# Altium project LEDesigner.PrjPcb
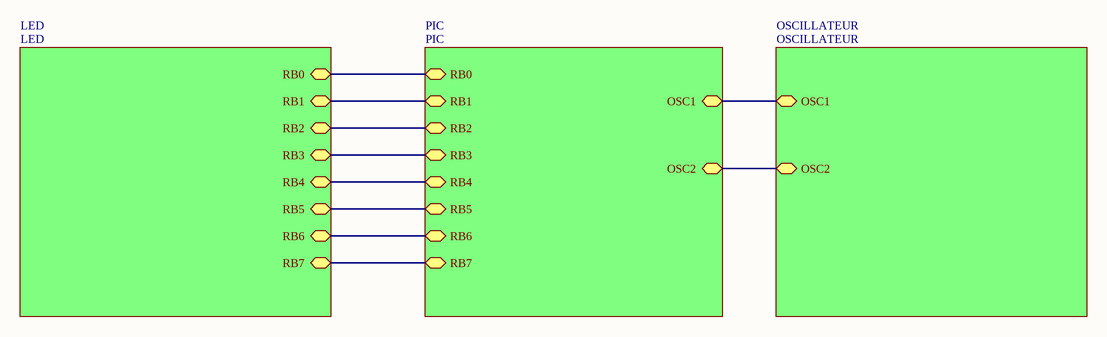
[diagram p0: Afficheur.SchDoc]
4 sheets, 26 parts. Net scope: hierarchical (ports join the sheet entries above them; power ports are global).
Board file: PCB1.PcbDoc
Sheets:
  Afficheur.SchDoc
    PIC = PIC.SchDoc
    OSCILLATEUR = OSCILLATEUR.SchDoc
  LED .SchDoc

## Sheet Afficheur.SchDoc
size A4

### Sub-sheets
LED = LED (file not in this document): RB0, RB1, RB2, RB3, RB4, RB5, RB6, RB7
OSCILLATEUR = OSCILLATEUR: OSC1, OSC2
PIC = PIC: RB0, RB1, RB2, RB3, RB4, RB5, RB6, RB7, OSC1, OSC2

### Nets
NetC3_1: sheet PIC/OSC1, sheet OSCILLATEUR/OSC1
NetC4_1: sheet PIC/OSC2, sheet OSCILLATEUR/OSC2
NetU?_6: sheet PIC/RB0, sheet LED/RB0
NetU?_7: sheet PIC/RB1, sheet LED/RB1
NetU?_8: sheet PIC/RB2, sheet LED/RB2
NetU?_9: sheet PIC/RB3, sheet LED/RB3
NetU?_10: sheet PIC/RB4, sheet LED/RB4
NetU?_11: sheet PIC/RB5, sheet LED/RB5
NetU?_12: sheet PIC/RB6, sheet LED/RB6
NetU?_13: sheet PIC/RB7, sheet LED/RB7

## Sheet PIC.SchDoc
size A4
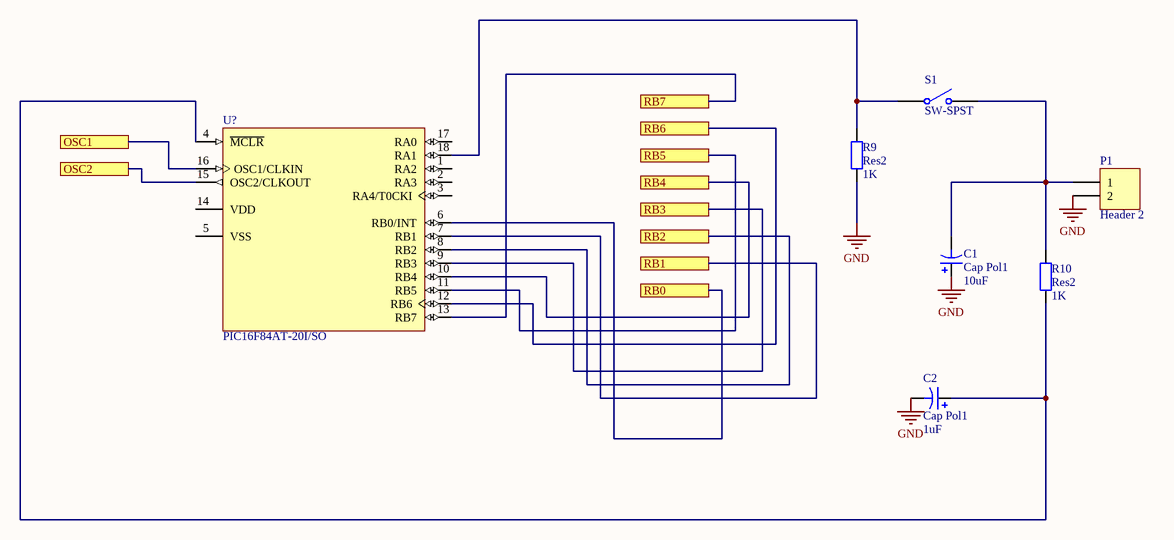
[diagram p1: PIC.SchDoc]

### Parts
C1  Cap Pol1  value 10uF  [RB7.6-15]
C2  Cap Pol1  value 1uF  [RB7.6-15]
P1  Header 2  [HDR1X2]
R9  Res2  value 1K  [AXIAL-0.4]
R10  Res2  value 1K  [AXIAL-0.4]
S1  SW-SPST  [SPST-2]
U?  PIC16F84AT-20I/SO  [SOIC-SO18_N]

### Ports
OSC1, OSC2, RB0, RB1, RB2, RB3, RB4, RB5, RB6, RB7

### Nets
GND: C1.1 C2.2 P1.2 R9.1
NetC1_2: C1.2 P1.1 R10.2 S1.2(NO)
NetC2_1: C2.1 R10.1 U?.4(~{MCLR})
NetC3_1: U?.16(OSC1/CLKIN) ; port OSC1
NetC4_1: U?.15(OSC2/CLKOUT) ; port OSC2
NetR9_2: R9.2 S1.1(COMMON) U?.18(RA1)
NetU?_6: U?.6(RB0/INT) ; port RB0
NetU?_7: U?.7(RB1) ; port RB1
NetU?_8: U?.8(RB2) ; port RB2
NetU?_9: U?.9(RB3) ; port RB3
NetU?_10: U?.10(RB4) ; port RB4
NetU?_11: U?.11(RB5) ; port RB5
NetU?_12: U?.12(RB6) ; port RB6
NetU?_13: U?.13(RB7) ; port RB7

Not connected (* = marked no-connect by the designer): U? 1(RA2) 2(RA3) 3(RA4/T0CKI) 5(VSS) 14(VDD) 17(RA0)

### Library data of the parts
C1 C2 = Cap Pol1: Polarized Capacitor (Radial); Published: 8-Jun-2000; LatestRevisionDate: 17-Jul-2002; LatestRevisionNote: Re-released for DXP Platform.; PackageReference: RB7.6-15; Publisher: Altium Limited; PackageDescription: Polarized Capacitor (Radial); 2 Leads
P1 = Header 2: Header, 2-Pin; LatestRevisionDate: 17-Jul-2002; LatestRevisionNote: Re-released for DXP Platform.; Publisher: Altium Limited
R9 R10 = Res2: Resistor; Published: 8-Jun-2000; LatestRevisionDate: 17-Jul-2002; LatestRevisionNote: Re-released for DXP Platform.; PackageReference: AXIAL-0.4; Publisher: Altium Limited; PackageDescription: Axial Device, Thru-Hole; 2 Leads; 0.4 in Pin Spacing
S1 = SW-SPST: Single-Pole, Single-Throw Switch; Published: 24-Mar-1999; LatestRevisionDate: 17-Jul-2002; LatestRevisionNote: Re-released for DXP Platform.; PackageReference: SPST-2; Publisher: Altium Limited; PackageDescription: Switch; 2 Leads
U? = PIC16F84AT-20I/SO: Enhanced FLASH/EEPROM 8-Bit Microcontroller, 1K (x14-Bit words) FLASH, 68 Bytes RAM, 20 MHz, 18-Pin SOIC, Standard VDD Range, Industrial Temperature, Tape and Reel; Published: 11-Oct-2004; LatestRevisionDate: 29-Jan-2009; LatestRevisionNote: Sch. layout revised. 3D Model Removed.; DatasheetVersion: revB, Aug-2001; PackageVersion: revBB, Aug-2009; PackageReference: SOIC-SO18; Publisher: Altium Limited; PackageDescription: 18-Lead Plastic Small Outline (SO) - Wide 7.50mm Body [SOIC]; Supplier 1: Digi-Key; Supplier Part Number 1: PIC16F84AT-20I/SO-ND; Code_JEDEC: MS-013; ComponentLink1Description: Datasheet; ComponentLink1URL: http://ww1.microchip.com/downloads/en/DeviceDoc/35007b.pdf; ComponentLink2Description: Packaging Specification; ComponentLink2URL: http://www.microchip.com/stellent/groups/techpub_sg/documents/packagingspec/en012702.pdf; ComponentLink3Description: Microchip.com Home; ComponentLink3URL: http://www.microchip.com/

## Sheet OSCILLATEUR.SchDoc
size A4
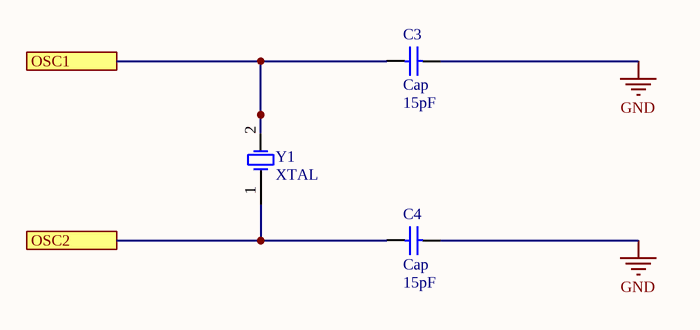
[diagram p2: OSCILLATEUR.SchDoc]

### Parts
C3  Cap  value 15pF  [RAD-0.2]
C4  Cap  value 15pF  [RAD-0.2]
Y1  XTAL  [R38]

### Ports
OSC1, OSC2

### Nets
GND: C3.2 C4.2
NetC3_1: C3.1 Y1.2(OSC2) ; port OSC1
NetC4_1: C4.1 Y1.1(OSC1) ; port OSC2

### Library data of the parts
C3 C4 = Cap: Capacitor; Published: 8-Jun-2000; LatestRevisionDate: 17-Jul-2002; LatestRevisionNote: Re-released for DXP Platform.; PackageReference: RAD-0.3; Publisher: Altium Limited; PackageDescription: Radial Cap, Thru-Hole; 2 Leads; 0.3 in Pin Spacing
Y1 = XTAL: Crystal Oscillator; Published: 8-Jun-2000; LatestRevisionDate: 17-Jul-2002; LatestRevisionNote: Re-released for DXP Platform.; PackageReference: R38; Publisher: Altium Limited; PackageDescription: Crystal, Thru-Hole; 2 Leads; Body 3.1 x 8.2 mm (Dia.xH)

## Sheet LED .SchDoc
size A4
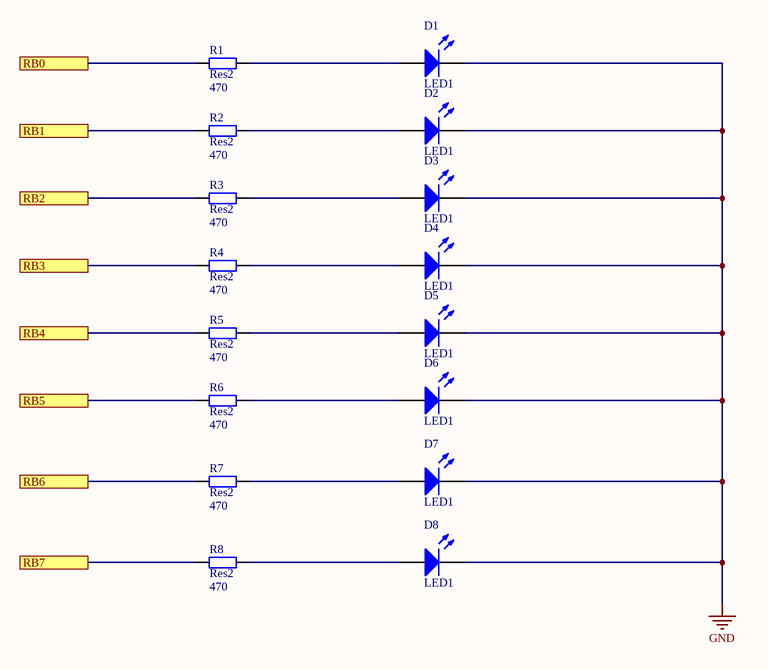
[diagram p3: LED .SchDoc]

### Parts
D1  LED1  [LED-1]
D2  LED1  [LED-1]
D3  LED1  [LED-1]
D4  LED1  [LED-1]
D5  LED1  [LED-1]
D6  LED1  [LED-1]
D7  LED1  [LED-1]
D8  LED1  [LED-1]
R1  Res2  value 470  [AXIAL-0.4]
R2  Res2  value 470  [AXIAL-0.4]
R3  Res2  value 470  [AXIAL-0.4]
R4  Res2  value 470  [AXIAL-0.4]
R5  Res2  value 470  [AXIAL-0.4]
R6  Res2  value 470  [AXIAL-0.4]
R7  Res2  value 470  [AXIAL-0.4]
R8  Res2  value 470  [AXIAL-0.4]

### Ports
RB0, RB1, RB2, RB3, RB4, RB5, RB6, RB7

### Nets
GND: D1.2(K) D2.2(K) D3.2(K) D4.2(K) D5.2(K) D6.2(K) D7.2(K) D8.2(K)
NetD1_1: D1.1(A) R1.2
NetD2_1: D2.1(A) R2.2
NetD3_1: D3.1(A) R3.2
NetD4_1: D4.1(A) R4.2
NetD5_1: D5.1(A) R5.2
NetD6_1: D6.1(A) R6.2
NetD7_1: D7.1(A) R7.2
NetD8_1: D8.1(A) R8.2
NetR1_1: R1.1 ; port RB0
NetR2_1: R2.1 ; port RB1
NetR3_1: R3.1 ; port RB2
NetR4_1: R4.1 ; port RB3
NetR5_1: R5.1 ; port RB4
NetR6_1: R6.1 ; port RB5
NetR7_1: R7.1 ; port RB6
NetR8_1: R8.1 ; port RB7

### Library data of the parts
D1-D8 = LED1: Typical RED GaAs LED; Published: 8-Jun-2000; LatestRevisionDate: 08-Jul-2005; LatestRevisionNote: Mech Layer 1 removed.; PackageReference: LED-1; Publisher: Altium Limited; PackageDescription: LED; 2 Leads
R1-R8 = Res2: Resistor; Published: 8-Jun-2000; LatestRevisionDate: 17-Jul-2002; LatestRevisionNote: Re-released for DXP Platform.; PackageReference: AXIAL-0.4; Publisher: Altium Limited; PackageDescription: Axial Device, Thru-Hole; 2 Leads; 0.4 in Pin Spacing

## Nets that join several sheets
GND: PIC (C1.1 C2.2 P1.2 R9.1), OSCILLATEUR (C3.2 C4.2), LED  (8 pins)
NetC3_1: PIC (U?.16), OSCILLATEUR (C3.1 Y1.2)
NetC4_1: PIC (U?.15), OSCILLATEUR (C4.1 Y1.1)